# EAGLE design AudioMega HaGeHa SMD v101 (EAGLE 6.3)
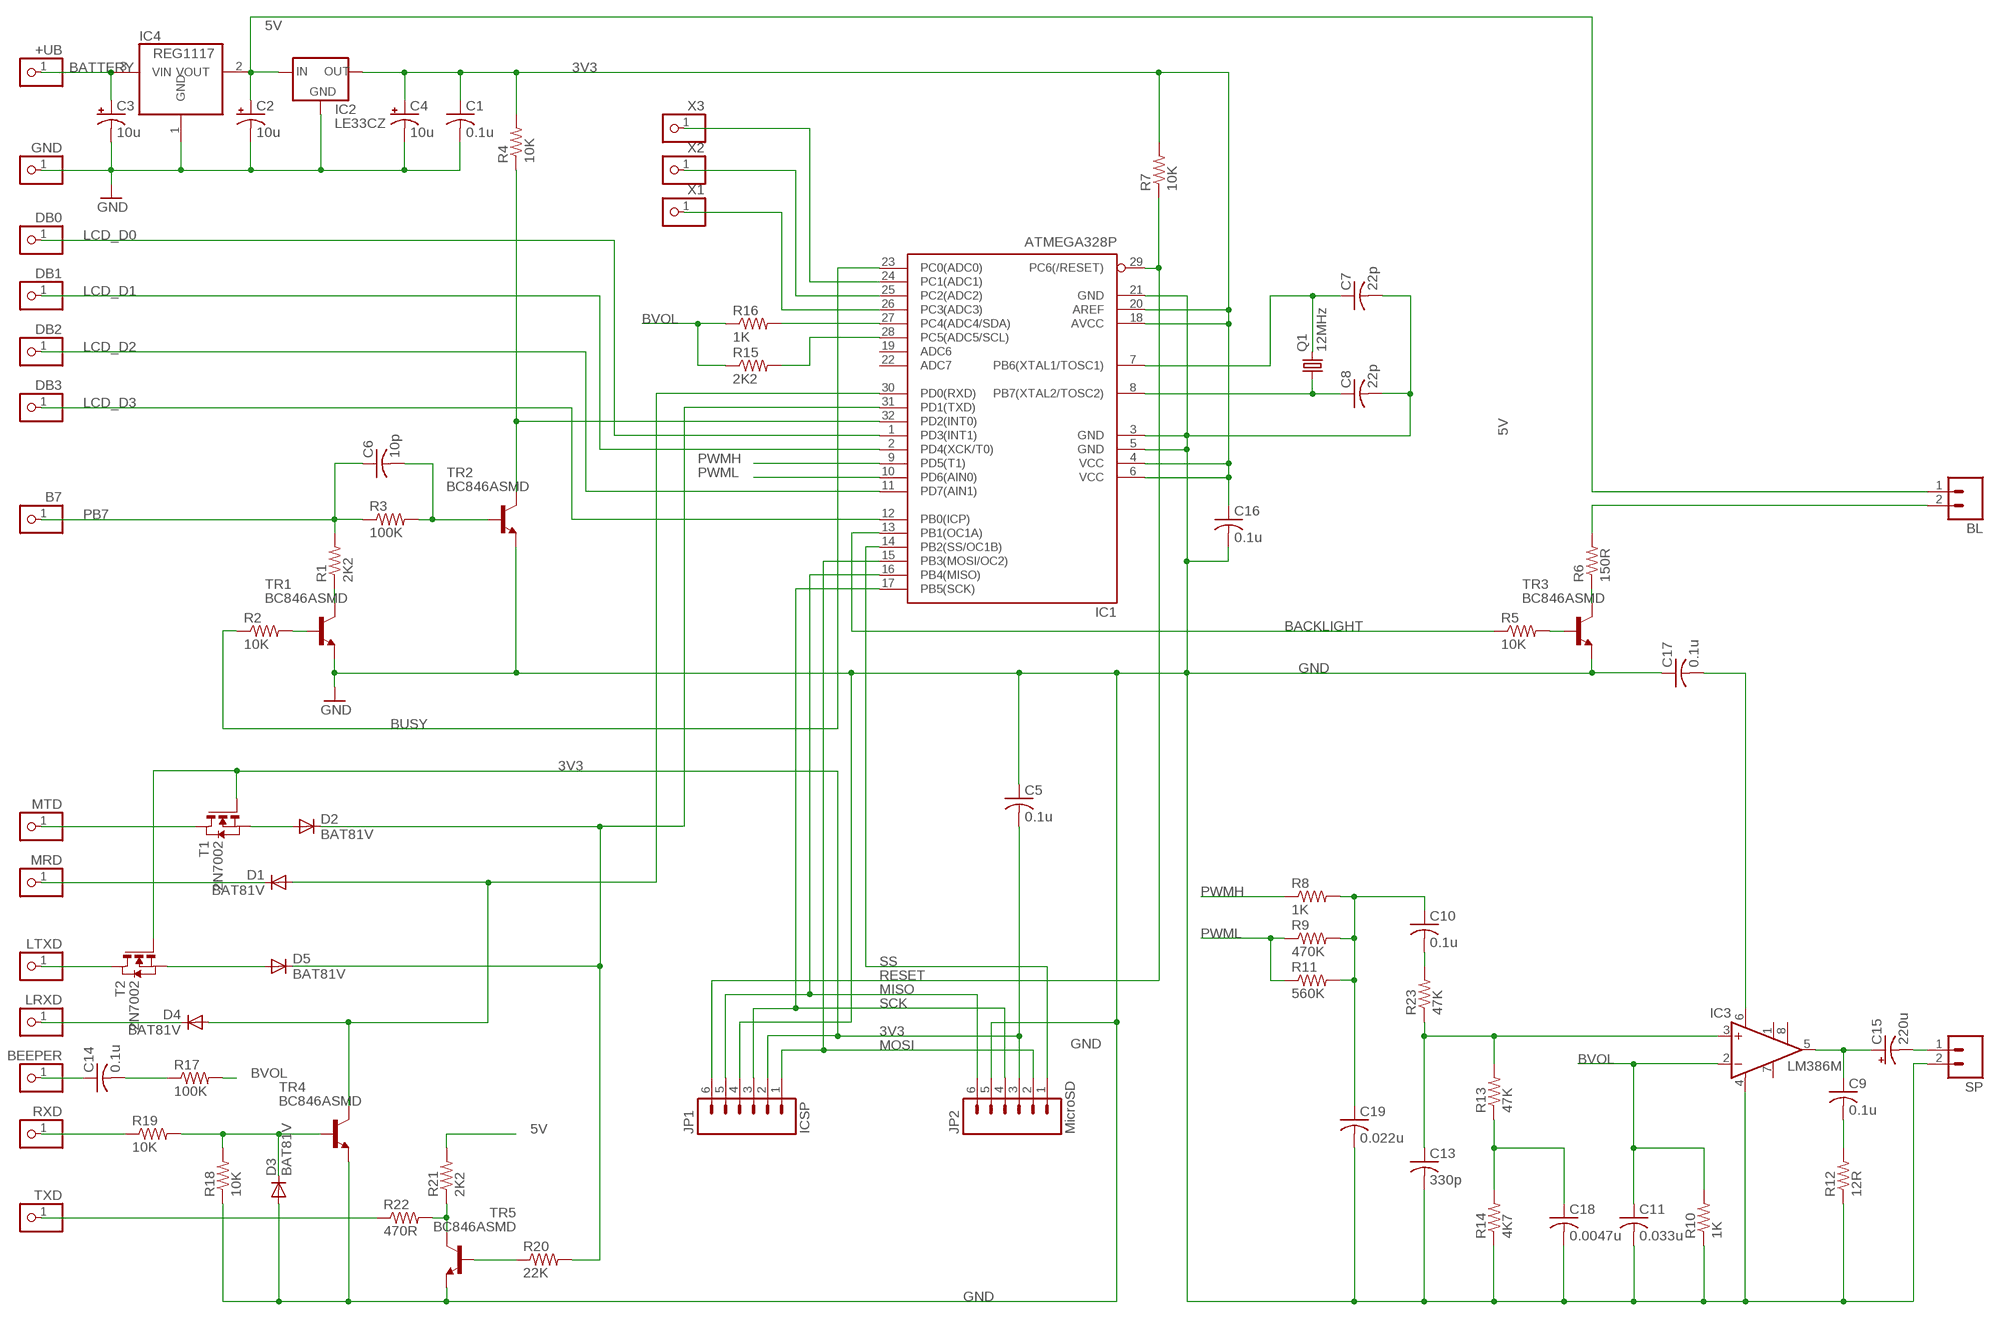
[diagram p0: schematic, sheet 1]

## Parts
+UB  PINHD-1X1  [1X01]
B7  PINHD-1X1  [1X01]
BEEPER  PINHD-1X1  [1X01]
BL  M02PTH  [1X02]
C1  0.1u  C-USC1206  [C1206]
C2  10u  CPOL-USA/3216-18R  [A/3216-18R]
C3  10u  CPOL-USA/3216-18R  [A/3216-18R]
C4  10u  CPOL-USA/3216-18R  [A/3216-18R]
C5  0.1u  C-USC1206  [C1206]
C6  10p  C-USC1206  [C1206]
C7  22p  C-USC1206  [C1206]
C8  22p  C-USC1206  [C1206]
C9  0.1u  C-USC1206  [C1206]
C10  0.1u  C-USC1206  [C1206]
C11  0.033u  C-USC1206  [C1206]
C13  330p  C-USC1206  [C1206]
C14  0.1u  C-USC1206  [C1206]
C15  220u  CPOL-USCT7343  [CT7343]
C16  0.1u  C-USC1206  [C1206]
C17  0.1u  C-USC1206  [C1206]
C18  0.0047u  C-USC1206  [C1206]
C19  0.022u  C-USC1206  [C1206]
D1  BAT81V  DIODE-SOD123  [SOD123]
D2  BAT81V  DIODE-SOD123  [SOD123]
D3  BAT81V  DIODE-SOD123  [SOD123]
D4  BAT81V  DIODE-SOD123  [SOD123]
D5  BAT81V  DIODE-SOD123  [SOD123]
DB0  PINHD-1X1  [1X01]
DB1  PINHD-1X1  [1X01]
DB2  PINHD-1X1  [1X01]
DB3  PINHD-1X1  [1X01]
GND  PINHD-1X1  [1X01]
IC1  ATMEGA328P  MEGA8-AI  [TQFP32-08]
IC2  LE33CZ  XC63FPM  [SOT23]
IC3  LM386M  LM386M-1  [SO08]
IC4  REG1117  [SOT223]
JP1  ICSP  M06SIP  [1X06]
JP2  MicroSD  M06SIP  [1X06]
LRXD  PINHD-1X1  [1X01]
LTXD  PINHD-1X1  [1X01]
MRD  PINHD-1X1  [1X01]
MTD  PINHD-1X1  [1X01]
Q1  12MHz  CRYSTAL5X3  [CRYSTAL-SMD-5X3]
R1  2K2  R-US_R1206  [R1206]
R2  10K  R-US_R1206  [R1206]
R3  100K  R-US_R1206  [R1206]
R4  10K  R-US_R1206  [R1206]
R5  10K  R-US_R1206  [R1206]
R6  150R  R-US_R1206  [R1206]
R7  10K  R-US_R1206  [R1206]
R8  1K  R-US_R1206  [R1206]
R9  470K  R-US_R1206  [R1206]
R10  1K  R-US_R1206  [R1206]
R11  560K  R-US_R1206  [R1206]
R12  12R  R-US_R1206  [R1206]
R13  47K  R-US_R1206  [R1206]
R14  4K7  R-US_R1206  [R1206]
R15  2K2  R-US_R1206  [R1206]
R16  1K  R-US_R1206  [R1206]
R17  100K  R-US_R1206  [R1206]
R18  10K  R-US_R1206  [R1206]
R19  10K  R-US_R1206  [R1206]
R20  22K  R-US_R1206  [R1206]
R21  2K2  R-US_R1206  [R1206]
R22  470R  R-US_R1206  [R1206]
R23  47K  R-US_R1206  [R1206]
RXD  PINHD-1X1  [1X01]
SP  M02PTH  [1X02]
T1  2N7002  NMOSSOT23  [SOT-23]
T2  2N7002  NMOSSOT23  [SOT-23]
TR1  BC846ASMD  [SOT23]
TR2  BC846ASMD  [SOT23]
TR3  BC846ASMD  [SOT23]
TR4  BC846ASMD  [SOT23]
TR5  BC846ASMD  [SOT23]
TXD  PINHD-1X1  [1X01]
X1  PINHD-1X1  [1X01]
X2  PINHD-1X1  [1X01]
X3  PINHD-1X1  [1X01]

## Nets
3V3: C1.1 C4.+ C5.2 C16.1 IC1.4(VCC) IC1.6(VCC) IC1.18(AVCC) IC1.20(AREF) IC2.2(OUT) JP1.2 JP2.3 R4.2 R7.2 T1.3(G) T2.3(G)
5V: BL.1 C2.+ IC2.3(IN) IC4.2(VOUT) R21.2
BACKLIGHT: IC1.13(PB1(OC1A)) R5.1
BATTERY: +UB.1 C3.+ IC4.3(VIN)
BUSY: IC1.23(PC0(ADC0)) R2.1
BVOL: C11.1 IC3.2(-IN) R10.2 R15.1 R16.1 R17.2
GND: C1.2 C2.- C3.- C4.- C5.1 C7.2 C8.2 C11.2 C13.2 C16.2 C17.1 C18.2 C19.2 D3.A GND.1 IC1.3(GND) IC1.5(GND) IC1.21(GND) IC2.1(GND) IC3.4(GND) IC4.1(GND) JP1.4 JP2.5 R10.1 R12.1 R14.1 R18.1 SP.2 TR1.2(E) TR2.2(E) TR3.2(E) TR4.2(E) TR5.2(E)
LCD_D0: DB0.1 IC1.1(PD3(INT1))
LCD_D1: DB1.1 IC1.2(PD4(XCK/T0))
LCD_D2: DB2.1 IC1.11(PD7(AIN1))
LCD_D3: DB3.1 IC1.12(PB0(ICP))
MISO: IC1.16(PB4(MISO)) JP1.5 JP2.6
MOSI: IC1.15(PB3(MOSI/OC2)) JP1.1 JP2.2
N$2: R21.1 R22.2 TR5.3(C)
N$3: R22.1 TXD.1
N$4: R20.1 TR5.1(B)
N$5: IC1.28(PC5(ADC5/SCL)) R15.2
N$6: IC1.27(PC4(ADC4/SDA)) R16.2
N$7: IC1.26(PC3(ADC3)) X1.1
N$8: IC1.25(PC2(ADC2)) X2.1
N$9: IC1.24(PC1(ADC1)) X3.1
N$10: R19.1 RXD.1
N$11: D3.C R18.2 R19.2 TR4.1(B)
N$12: D4.C LRXD.1
N$14: D5.A T2.2(S)
N$15: D2.A T1.2(S)
N$16: MTD.1 T1.1(D)
N$17: LTXD.1 T2.1(D)
N$18: D1.C MRD.1
N$21: R1.1 TR1.3(C)
N$22: R2.2 TR1.1(B)
N$23: C6.2 R3.2 TR2.1(B)
N$24: BEEPER.1 C14.1
N$25: C14.2 R17.1
N$26: R5.2 TR3.1(B)
N$27: R6.1 TR3.3(C)
N$28: C10.2 R23.2
N$29: IC1.32(PD2(INT0)) R4.1 TR2.3(C)
N$30: C8.1 IC1.8(PB7(XTAL2/TOSC2)) Q1.1
N$31: C7.1 IC1.7(PB6(XTAL1/TOSC1)) Q1.3
N$33: BL.2 R6.2
N$34: C9.1 C15.+ IC3.5(OUT)
N$35: C9.2 R12.2
N$36: C15.- SP.1
N$37: C17.2 IC3.6(VS)
N$38: C13.1 IC3.3(+IN) R13.2 R23.1
N$39: C10.1 C19.1 R8.2 R9.2 R11.2
N$40: C18.1 R13.1 R14.2
PB7: B7.1 C6.1 R1.2 R3.1
PWMH: IC1.9(PD5(T1)) R8.1
PWML: IC1.10(PD6(AIN0)) R9.1 R11.1
RESET: IC1.29(PC6(/RESET)) JP1.6 R7.1
RXD: D1.A D4.A IC1.30(PD0(RXD)) TR4.3(C)
SCK: IC1.17(PB5(SCK)) JP1.3 JP2.4
SS: IC1.14(PB2(SS/OC1B)) JP2.1
TXD: D2.C D5.C IC1.31(PD1(TXD)) R20.2
Unconnected: IC1.19(ADC6) IC1.22(ADC7) IC3.1(GAIN) IC3.7(BYPASS) IC3.8(GAIN)

## Library data of the parts
+UB B7 BEEPER DB0 DB1-DB3 GND LRXD LTXD MRD MTD RXD TXD X1-X3 = pinhead:PINHD-1X1: PIN HEADER
BL SP = SparkFun-Connectors:M02: Header 2 Standard 2-pin 0.1" header. Use with straight break away headers (SKU : PRT-00116), right angle break away headers (PRT-00553), swiss pins (PRT-00743), machine pins (PRT-00117), and female headers (PRT-00115). Molex polarized connector foot print use with SKU : PRT-08233 with associated crimp pins and housings.
C1 C5-C11 C13 C14 C16-C19 = rcl:C-US: CAPACITOR, American symbol
C2-C4 C15 = rcl:CPOL-US: POLARIZED CAPACITOR, American symbol
D1-D5 = diode:DIODE-: DIODE
IC1 = atmel:MEGA8: MICROCONTROLLER 8 Kbytes FLASH, 1 kbytes SRAM, 512 bytes EEPROM, USART, 6-channel 10 bit ADC, 2-channel 8 bit ADC Pin compatible with Atmega48, ATMega88, ATMega168 Source: avr.lbr; MPN: ATMEGA8-16AU; OC_FARNELL: 9171371; OC_NEWARK: 73M8863
IC2 = v-reg:XC63FP: Positiv Voltage Regulators www.torex.co.jp/english/product/pro02/pdf/0201_xc62fp.pdf
IC3 = linear:LM386?-*: Low Voltage Audio Power Amplifier Source: http://cache.national.com/ds/LM/LM386.pdf
IC4 = burr-brown:REG1117: 800mA and 1A Low Dropout (LDO) Positive Regulator 1.8V, 2.5V, 2.85V, 3.3V, 5V, and Adj; MPN: REG1117; OC_FARNELL: 1097566; OC_NEWARK: 14P6981
JP1 JP2 = SparkFun-Connectors:M06: Header 6 Standard 6-pin 0.1" header. Use with straight break away headers (SKU : PRT-00116), right angle break away headers (PRT-00553), swiss pins (PRT-00743), machine pins (PRT-00117), and female headers (PRT-00115). Molex polarized connector foot print use with SKU : PRT-08094 with associated crimp pins and housings. NOTES ON THE VARIANTS LOCK and LOCK_LONGPADS... This footprint was designed to help hold the alignment of a through-hole component (i.e. 6-pin header) while soldering it into place. You may notice that each hole has been shifted either up or down by 0.005 of an inch from it's more standard position (which is a perfectly straight line). This slight alteration caused the pins (the squares in the middle) to touch the edges of the holes. Because they are alternating, it causes a "brace" to hold the component in place. 0.005 has proven to be the perfect amount of "off-center" position when using our standard breakaway headers. Although looks a little odd when you look at the bare footprint, once you have a header in there, the alteration is very hard to notice. Also, if you push a header all the way into place, it is covered up entirely on the bottom side. This idea of altering the position of holes to aid alignment will be further integrated into the Sparkfun Library for other footprints. It can help hold any component with 3 or more connection pins.
Q1 = SparkFun-FreqCtrl:CRYSTAL: Various standard crystals. Proven footprints. Spark Fun Electronics SKU : COM-00534
R1-R23 = rcl:R-US_: RESISTOR, American symbol
T1 T2 = zetex:NMOSSOT23: MOS FET; OC_FARNELL: unknown; OC_NEWARK: unknown
TR1-TR5 = transistor-npn:BC846*: NPN Transistor

## Board
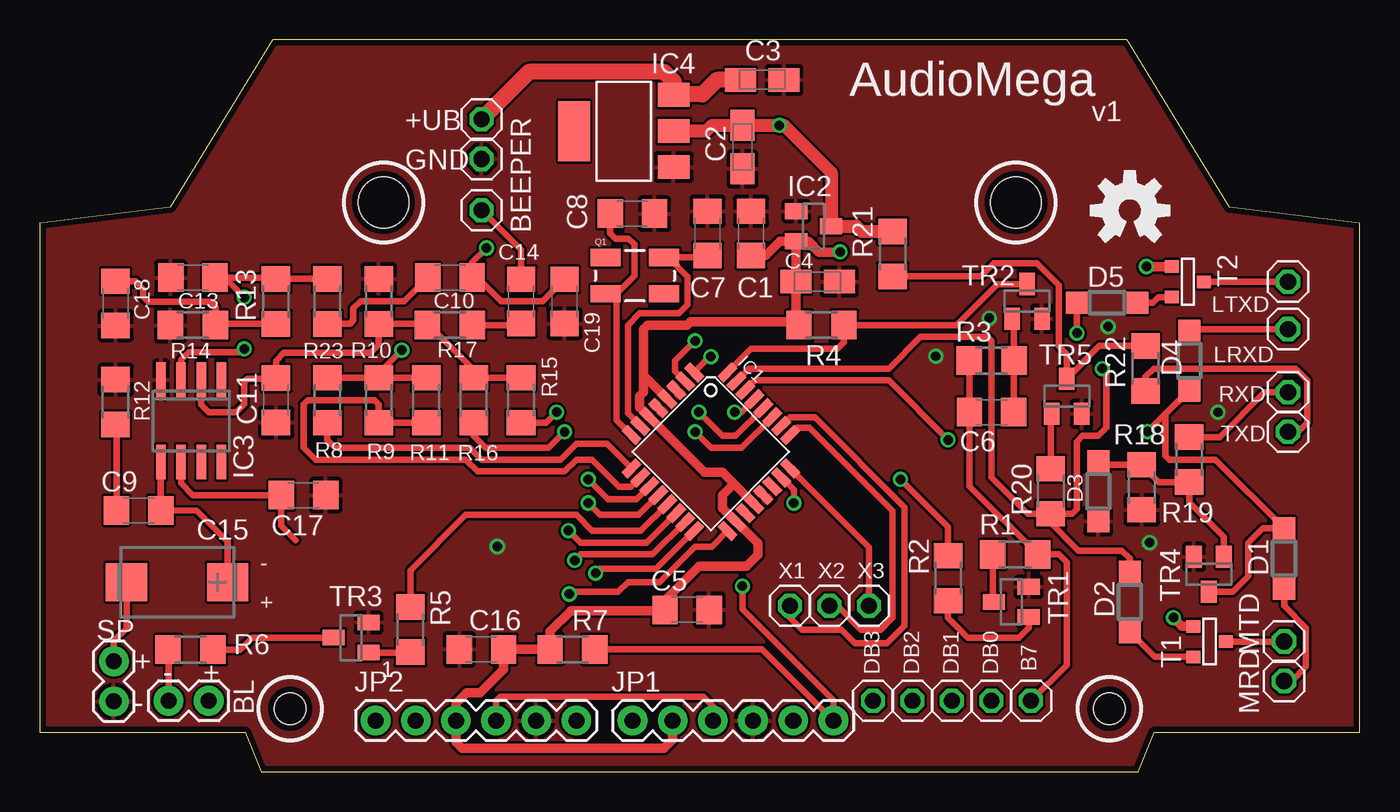
[diagram p1: board, top side]
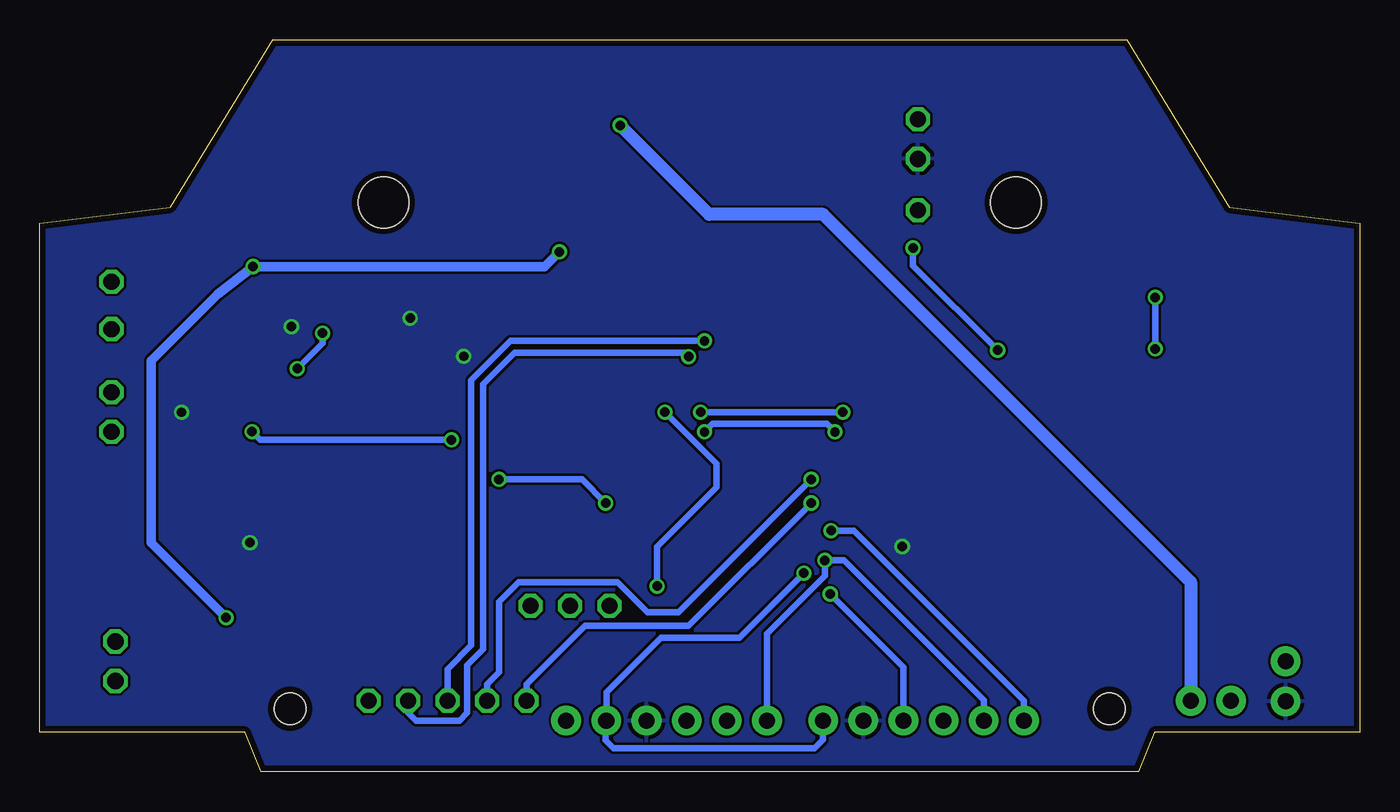
[diagram p2: board, bottom side, seen from below]

Size 83.5 x 46.3 mm. Coordinates in mm from the lower left corner, seen from the top.
Outline: 0,2.5 13,2.5 14,0 69.5,0 70.5,2.5 83.5,2.5 83.5,34.7 75.25,35.7 68.75,46.3 14.75,46.3 8.25,35.7 0,34.7 0,2.5
Copper layers (1*16): Top 0.0356mm / dielectric 1.5011mm / Bottom 0.0356mm
Design rules "LaenPCBOrder": minimum track width 6mil, minimum drill 13mil, track to track 6mil, track to pad 6mil, pad to pad 6mil, via to via 6mil, smd to smd 6mil, copper to edge 15mil, drill to drill 6mil, minimum pad ring 7mil, minimum via ring 7mil, stop-mask expansion 4mil, vias tented up to drill 0mil, thermal gap 10mil
Holes 2 mm at 15.85,4 67.65,4
Holes 3.2 mm at 21.75,36 61.75,36

### Footprints (pad centres in the part's own frame; a part is rotated, then mirrored left to right if it is on the bottom)
1X01 = drill 1.016 octagon: 1 0,0
1X02 = drill 1.016 pad 1.88: 1 0,0; 2 2.54,0
C1206 = smd 1.6 x 1.8: 1 -1.4,0; 2 1.4,0
A/3216-18R = smd 1.95 x 1.5: + 1.375,0; - -1.375,0
CT7343 = smd 2.6 x 2.4: + -3.2,0; - 3.2,0
SOD123 = smd 1.4 x 1.4: A 1.9,0; C -1.9,0
TQFP32-08 = smd 1.27 x 0.559: 1 -4.293,2.8; 2 -4.293,2; 3 -4.293,1.2; 4 -4.293,0.4; 5 -4.293,-0.4; 6 -4.293,-1.2; 7 -4.293,-2; 8 -4.293,-2.8; 17 4.293,-2.8; 18 4.293,-2; 19 4.293,-1.2; 20 4.293,-0.4; 21 4.293,0.4; 22 4.293,1.2; 23 4.293,2; 24 4.293,2.8 | smd 0.559 x 1.27: 9 -2.8,-4.293; 10 -2,-4.293; 11 -1.2,-4.293; 12 -0.4,-4.293; 13 0.4,-4.293; 14 1.2,-4.293; 15 2,-4.293; 16 2.8,-4.293; 25 2.8,4.293; 26 2,4.293; 27 1.2,4.293; 28 0.4,4.293; 29 -0.4,4.293; 30 -1.2,4.293; 31 -2,4.293; 32 -2.8,4.293
SOT23 = smd 1 x 1.4: 1 -0.95,-1.1; 2 0.95,-1.1; 3 0,1.1
SO08 = smd 0.6 x 2.2: 1 -1.905,-2.6; 2 -0.635,-2.6; 3 0.635,-2.6; 4 1.905,-2.6; 5 1.905,2.6; 6 0.635,2.6; 7 -0.635,2.6; 8 -1.905,2.6
SOT223 = smd 1.499 x 2.007: 1 -2.261,-3.15; 2 0.025,-3.15; 3 2.311,-3.15 | smd 3.81 x 2.007: 4 0,3.15
1X06 = drill 1.016 pad 1.88: 1 0,0; 2 2.54,0; 3 5.08,0; 4 7.62,0; 5 10.16,0; 6 12.7,0
CRYSTAL-SMD-5X3 = smd 1.9 x 1.1: 1 -1.85,-1.15; 2 1.85,-1.15; 3 1.85,1.15; 4 -1.85,1.15
R1206 = smd 1.6 x 1.803: 1 -1.422,0; 2 1.422,0
SOT-23 = smd 0.787 x 0.889: 1 0.025,-1.016; 2 -0.94,1.016; 3 0.991,1.016

### Placement (x,y rotation side)
+UB  27.95,41.25 0 top
B7  62.7,4.5 0 top
BEEPER  27.95,35.5 0 top
BL  10.7,4.5 180 top
C1  44.99,34.05 90 top
C2  44.45,39.5 90 top
C3  45.7,43.75 180 top
C4  49.2,31 180 top
C5  40.95,10.25 180 top
C6  60.2,22.75 0 top
C7  42.24,34.05 90 top
C8  37.49,35.3 0 top
C9  6.27,16.53 180 top
C10  25.95,31.25 180 top
C11  14.95,23.5 270 top
C13  9.7,31.25 180 top
C14  30.45,29.75 270 top
C15  8.7,12 180 top
C16  27.95,7.75 180 top
C17  16.7,17.5 180 top
C18  4.81,29.62 270 top
C19  33.2,29.75 270 top
D1  78.7,13.5 90 top
D2  68.95,10.75 270 top
D3  66.95,17.75 270 top
D4  72.7,26 270 top
D5  67.51,29.67 0 top
DB0  60.2,4.5 0 top
DB1  57.7,4.5 0 top
DB2  55.2,4.5 0 top
DB3  52.7,4.5 0 top
GND  27.95,38.75 0 top
IC1  42.45,20.25 315 top
IC2  48.95,34.5 270 top
IC3  9.59,22.19 180 top
IC4  36.95,40.5 90 top
JP1  37.5,3.25 0 top
JP2  21.25,3.25 0 top
LRXD  78.95,28 0 top
LTXD  78.95,31 0 top
MRD  78.7,5.75 0 top
MTD  78.7,8.25 0 top
Q1  37.65,31.38 0 top
R1  61.7,13.75 0 top
R2  57.45,12.25 270 top
R3  60.2,26 0 top
R4  49.45,28.25 180 top
R5  23.45,9 270 top
R6  9.55,7.73 180 top
R7  33.7,7.75 180 top
R8  18.2,23.5 90 top
R9  21.45,23.5 90 top
R10  21.45,29.75 270 top
R11  24.45,23.5 90 top
R12  4.81,23.38 270 top
R13  14.95,29.75 90 top
R14  9.7,28.25 0 top
R15  30.45,23.5 270 top
R16  27.45,23.5 270 top
R17  25.95,28.25 180 top
R18  69.7,18 90 top
R19  72.7,19.75 270 top
R20  63.95,17.75 270 top
R21  53.95,32.75 90 top
R22  69.93,25.51 90 top
R23  18.2,29.75 270 top
RXD  78.95,24 0 top
SP  4.7,7 270 top
T1  73.99,8.22 90 top
T2  72.62,30.96 90 top
TR1  61.45,10.75 90 top
TR2  62.45,29.75 0 top
TR3  19.7,8.5 90 top
TR4  73.95,12.5 180 top
TR5  64.95,23.75 0 top
TXD  78.95,21.5 0 top
U$1  [OSHW-LOGO-M]  68.95,35.5 0 top
X1  47.45,10.5 180 top
X2  49.95,10.5 90 top
X3  52.45,10.5 90 top

### Tracks (layer width: path | path; a pad name or v marks a point on that pad's centre or on a via)
3V3  (via drill 0.6)
  Top 0.61: IC2.2 47.85,31.02 C4.+ 47.83,28.45 | 47.83,28.45 R4.2 | C16.1 R7.2 | 39.87,9.93 C5.2 | R7.2 | C1.1 45.93,32.65 46.82,33.54 IC2.2 | IC2.2 48.63,33.54 49.3,32.85 50.59,32.85 v50.62,32.88 | v70,31.95 T2.3 | T1.3 72.24,9.21 v71.7,9.75 | 47.83,28.45 41.15,28.45 40.95,28.25 38.45,28.25 38.2,28 38.2,25.07 | 38.2,25.07 IC1.4 | 38.2,25.07 38.2,24 37.95,23.75 37.95,23.05 IC1.6 42.05,18.96 43.19,18.96 43.79,18.36 43.79,18.34 | R7.2 32.29,7.76 32.29,8.89 33.6,10.2 39.5,10.2 C5.2 | IC1.20 43.79,18.34 | C5.2 39.55,10.85 41.7,13 44.7,13 45.44,13.74 45.44,14.45 44.09,15.8 IC1.18 43.2,16.67 43.2,17.5 43.79,18.09 43.79,18.34 | C16.1 29.33,7.75 | C16.1 29.34,6.49 27.85,5 27,5 26.33,4.33 JP2.3 26.34,1.89 26.73,1.5 39.5,1.5 40.04,2.04 JP1.2
  Bottom 0.61: v50.62,32.88 51.55,31.95 v70,31.95 72.25,30.2 76.45,26 76.45,14.5 v71.7,9.75
5V  (via drill 0.6)
  Top 0.813: IC4.2 42.17,40.52 42.53,40.88 C2.+ v46.79,40.88 47.09,40.88 50.07,37.89 50.07,34.52 IC2.3 51.65,34.5 51.98,34.17 R21.2
  Bottom 0.813: v46.79,40.88 41.16,35.25 33.95,35.25 10.7,12 BL.1
BACKLIGHT
  Top 0.406: R5.1 23.45,12.75 26.95,16.25 33.95,16.25 34.95,15.25 38.02,15.25 IC1.13
BATTERY
  Top 1.016: 40.12,42.83 IC4.3 | C3.+ 42.84,43.75 41.92,42.83 40.12,42.83 IC4.3 | IC4.3 40.1,43.65 39.5,44.25 30.95,44.25 +UB.1
BUSY  (via drill 0.6)
  Top 0.406: IC1.23 47.7,17.83 v47.7,17 | R2.1 57.45,15.5 v54.45,18.5
  Bottom 0.406: v47.7,17 49.2,18.5 v54.45,18.5
BVOL
  Top 0.406: IC3.2 10.22,23.23 10.7,22.75 12.45,22.75 12.95,23.25 12.95,24.66 13.15,24.86 14.91,24.86 C11.1 14.95,26 15.45,26.5 20.95,26.5 21.45,27 R10.2 24.45,28.33 R17.2 24.62,28.25 27.44,25.43 27.44,24.93 R16.1 R15.1
GND  (via drill 0.6)
  other vias: 28.95,14.25 70.2,14.5 60.06,28.69 67.57,28.15 56.68,26.28 74.52,22.74
  pour Top: 0,0 83.5,0 83.5,43.75 83.5,46.31 21.9,46.31 0,46.31
  pour Bottom: 0,0 83.44,0 83.44,46.4 0,46.4
LCD_D0  (via drill 0.6)
  Top 0.406: v42.45,26.25 42.38,26.25 IC1.1
  Bottom 0.406: DB0.1 60.2,3.75 59.7,3.25 56.95,3.25 56.45,3.75 56.45,6.75 55.45,7.75 55.45,24.5 53.45,26.5 42.7,26.5 v42.45,26.25
LCD_D1  (via drill 0.6)
  Top 0.406: IC1.2 40.2,25.33 40.2,26 v41.45,27.25
  Bottom 0.406: v41.45,27.25 53.7,27.25 56.2,24.75 56.2,8 57.7,6.5 DB1.1
LCD_D2  (via drill 0.6)
  Top 0.406: IC1.11 37.75,17.25 35.95,17.25 v34.7,18.5
  Bottom 0.406: DB2.1 55.2,5.54 54.45,6.29 54.45,10.75 53.2,12 46.95,12 45.06,10.11 43.09,10.11 v34.7,18.5
LCD_D3  (via drill 0.6)
  Top 0.406: IC1.12 37.88,16.25 35.45,16.25 v34.7,17
  Bottom 0.406: v34.7,17 42.45,9.25 49,9.25 52.7,5.55 DB3.1
MISO  (via drill 0.6)
  Top 0.406: IC1.16 39,12.84 35.44,12.84 v35.17,12.57
  Bottom 0.406: JP2.6 33.95,2.05 34.5,1.5 47.2,1.5 47.7,2 47.7,3.21 JP1.5 47.66,5.04 44.2,8.5 39.24,8.5 v35.17,12.57
MOSI  (via drill 0.6)
  Top 0.406: IC1.15 38.78,13.75 34.21,13.75 v33.84,13.38
  Bottom 0.406: JP1.1 37.5,8.75 33.84,12.41 v33.84,13.38 32.63,13.38 23.79,4.54 JP2.2
N$2
  Top 0.406: R22.2 67.03,26.93 TR5.3 64.95,26.4 64.45,26.9 64.45,30.78 63.07,32.16 60.36,32.16 59.53,31.33 R21.1
N$3
  Top 0.406: R22.1 69.93,24.98 70.45,25.5 79.45,25.5 80.18,24.77 80.18,22.09 79.59,21.5 TXD.1
N$4
  Top 0.406: TR5.1 63.95,22.6 R20.1
N$5  (via drill 0.6)
  Top 0.406: v41.7,22.75 43.2,21.25 44.02,21.25 IC1.28 | v32.7,22.75 32.03,22.08 R15.2
  Bottom 0.406: v41.7,22.75 v32.7,22.75
N$6  (via drill 0.6)
  Top 0.406: v33.2,21.5 32.2,20.5 28.2,20.5 27.45,21.25 R16.2 | v41.45,21.5 42.45,20.5 44.4,20.5 IC1.27
  Bottom 0.406: v41.45,21.5 40.95,22 33.7,22 v33.2,21.5
N$7
  Top 0.406: X1.1 47.45,9.75 48.2,9 50.7,9 51.57,8.13 53.58,8.13 54.7,9.25 54.7,16.75 49.02,22.43 47.46,22.43 IC1.26
N$8
  Top 0.406: X2.1 50.45,10.5 51.95,9 53.2,9 53.95,9.75 53.95,16.5 48.7,21.75 47.91,21.75 IC1.25
N$9
  Top 0.406: X3.1 52.45,14.21 IC1.24
N$10
  Top 0.406: R19.1 74.62,21.17 77.45,24 RXD.1
N$11
  Top 0.406: 74.95,13.65 TR4.1 74.89,14.87 72.7,17.06 R19.2 70.79,18.33 R18.2 67.18,19.42 D3.C
N$12
  Top 0.406: LRXD.1 72.8,28 D4.C
N$14
  Top 0.406: T2.2 70.76,30.02 70.4,29.66 D5.A
N$15
  Top 0.406: D2.A 70.52,7.28 T1.2
N$16
  Top 0.406: T1.1 MTD.1
N$17
  Top 0.406: T2.1 78.94,30.98 LTXD.1
N$18
  Top 0.406: D1.C 78.7,10.5 80.08,9.12 80.08,6.65 79.18,5.75 MRD.1
N$21
  Top 0.406: TR1.3 60.28,10.82 R1.1
N$22
  Top 0.406: 62.62,9.73 TR1.1 62.56,9.13 61.93,8.5 58.7,8.5 57.45,9.75 R2.2
N$23
  Top 0.406: TR2.1 61.62,28.53 R3.2 61.6,25.98 C6.2
N$24
  Top 0.406: C14.1 30.45,33 BEEPER.1
N$25
  Top 0.406: R17.1 30.35,28.25 C14.2
N$26
  Top 0.406: TR3.1 23.42,7.55 R5.2
N$27
  Top 0.406: R6.1 12.68,7.73 13.45,8.5 TR3.3
N$28
  Top 0.406: R23.2 19.63,28.33 19.84,28.54 19.84,29.31 20.29,29.76 23.06,29.76 C10.2
N$29
  Top 0.406: TR2.3 60.58,30.84 57.99,28.25 R4.1 50.87,27.17 50.45,26.75 44.99,26.75 IC1.32
N$30
  Top 0.406: C8.1 36.09,34.05 36.43,33.71 37.26,33.71 37.62,33.35 37.62,31.36 36.5,30.24 | 36.5,30.24 Q1.1 | 36.5,30.24 36.5,22.24 IC1.8
N$31
  Top 0.406: C7.1 42.12,32.53 Q1.3 39.76,32.53 40.99,31.3 40.99,29.54 40.45,29 37.95,29 37.2,28.25 37.2,22.67 IC1.7
N$33
  Top 0.406: BL.2 8.16,7.7 R6.2
N$34
  Top 0.406: C15.+ 11.9,14.55 9.95,16.5 C9.1 7.67,19.57 IC3.5
N$35
  Top 0.406: C9.2 4.87,21.9 R12.2
N$36
  Top 0.406: SP.1 4.7,8.29 5.51,9.1 C15.-
N$37
  Top 0.406: 16.2,14.64 15.28,15.56 15.28,17.48 C17.2 9.7,17.5 8.96,18.25 IC3.6
N$38  (via drill 0.6)
  Top 0.406: R23.1 R13.2 14.87,31.25 C13.1 11.7,31.25 v12.95,30 | v12.95,26.75 12.72,26.52 9.43,26.52 8.97,26.06 8.97,24.8 IC3.3
  Bottom 0.406: v12.95,30 v12.95,26.75
N$39  (via drill 0.6)
  Top 0.406: C19.1 31.8,29.75 29.2,29.75 27.7,31.25 C10.1 27.35,32.21 v28.26,33.12 | R8.2 R9.2 R11.2 21.53,24.92 21.45,25 21.45,25.2 v22.91,26.66
  Bottom 0.406: v22.91,26.66 28.26,32.01 v28.26,33.12
N$40
  Top 0.406: R13.1 11.2,28.33 R14.2 11.14,28.27 11.14,29.37 10.78,29.73 6.88,29.73 6.56,30.05 6.56,30.53 6.07,31.02 C18.1
PB7
  Top 0.406: R3.1 58.8,25.98 C6.1 58.8,18.07 R1.2 64.45,13.75 64.95,13.25 64.95,6.75 B7.1
PWMH
  Top 0.406: R8.1 18.2,21 18.7,20.5 27.2,20.5 27.95,19.75 32.95,19.75 33.95,20.75 35.88,20.75 IC1.9 37.4,19.2
PWML
  Top 0.406: 37.98,18.63 IC1.10 37.41,18.04 36.66,18.04 34.95,19.75 33.95,19.75 33.2,19 27.7,19 26.95,19.75 17.45,19.75 16.7,20.5 16.7,23.25 16.95,23.5 21.2,23.5 21.45,23.25 R9.1 R11.1
RESET  (via drill 0.6)
  Top 0.406: IC1.29 44.38,22.75 v43.95,22.75 | R7.1 45.7,7.75 JP1.6 50.2,4.55 44.45,10.3 v44.45,11.75
  Bottom 0.406: v44.45,11.75 44.45,14.25 40.7,18 40.7,19.5 v43.95,22.75
RXD  (via drill 0.6)
  Top 0.406: TR4.3 75.47,11.4 76.45,12.38 76.45,14.5 77.35,15.4 D1.A 74.35,19.75 71.45,19.75 71.2,20 71.2,22.6 D4.A 72.7,24.15 v70.06,21.51 | v57.45,21 53.7,24.75 45.25,24.75 IC1.30
  Bottom 0.406: v57.45,21 69.55,21 v70.06,21.51
SCK  (via drill 0.6)
  Top 0.406: IC1.17 42.52,14.25 41.45,14.25 39.2,12 37.2,12 36.59,11.39 33.64,11.39 v33.5,11.25 | JP1.3 42.58,4.17 42,4.75 29.12,4.75 28.87,4.5 JP2.4
  Bottom 0.406: v33.5,11.25 28.87,6.62 JP2.4
SS  (via drill 0.6)
  Top 0.406: IC1.14 38.4,14.5 34.2,14.5 v33.45,15.25
  Bottom 0.406: JP2.1 21.25,4.5 32,15.25 v33.45,15.25
TXD  (via drill 0.6)
  Top 0.406: R20.2 65.31,16.33 65.59,16.61 65.59,20.89 65.95,21.25 66.95,21.25 67.45,21.75 67.45,25.25 v67.2,25.5 | v65.6,27.74 v65.61,27.75 D5.C | R20.2 62.51,16.32 60.2,18.63 60.2,27.25 59.95,27.5 55.7,27.5 53.7,25.5 44.87,25.5 IC1.31 | D2.C 68.95,13.5 68.45,14 65.7,14 63.7,16 63.7,16.08 R20.2
  Bottom 0.406: v67.2,25.5 65.6,27.1 v65.6,27.74

### Text on the board
tNames: AudioMega | v1 | - | + | + | - | + | 1 | -